# Altium schematic sheet BQ78350.SchDoc
size A3
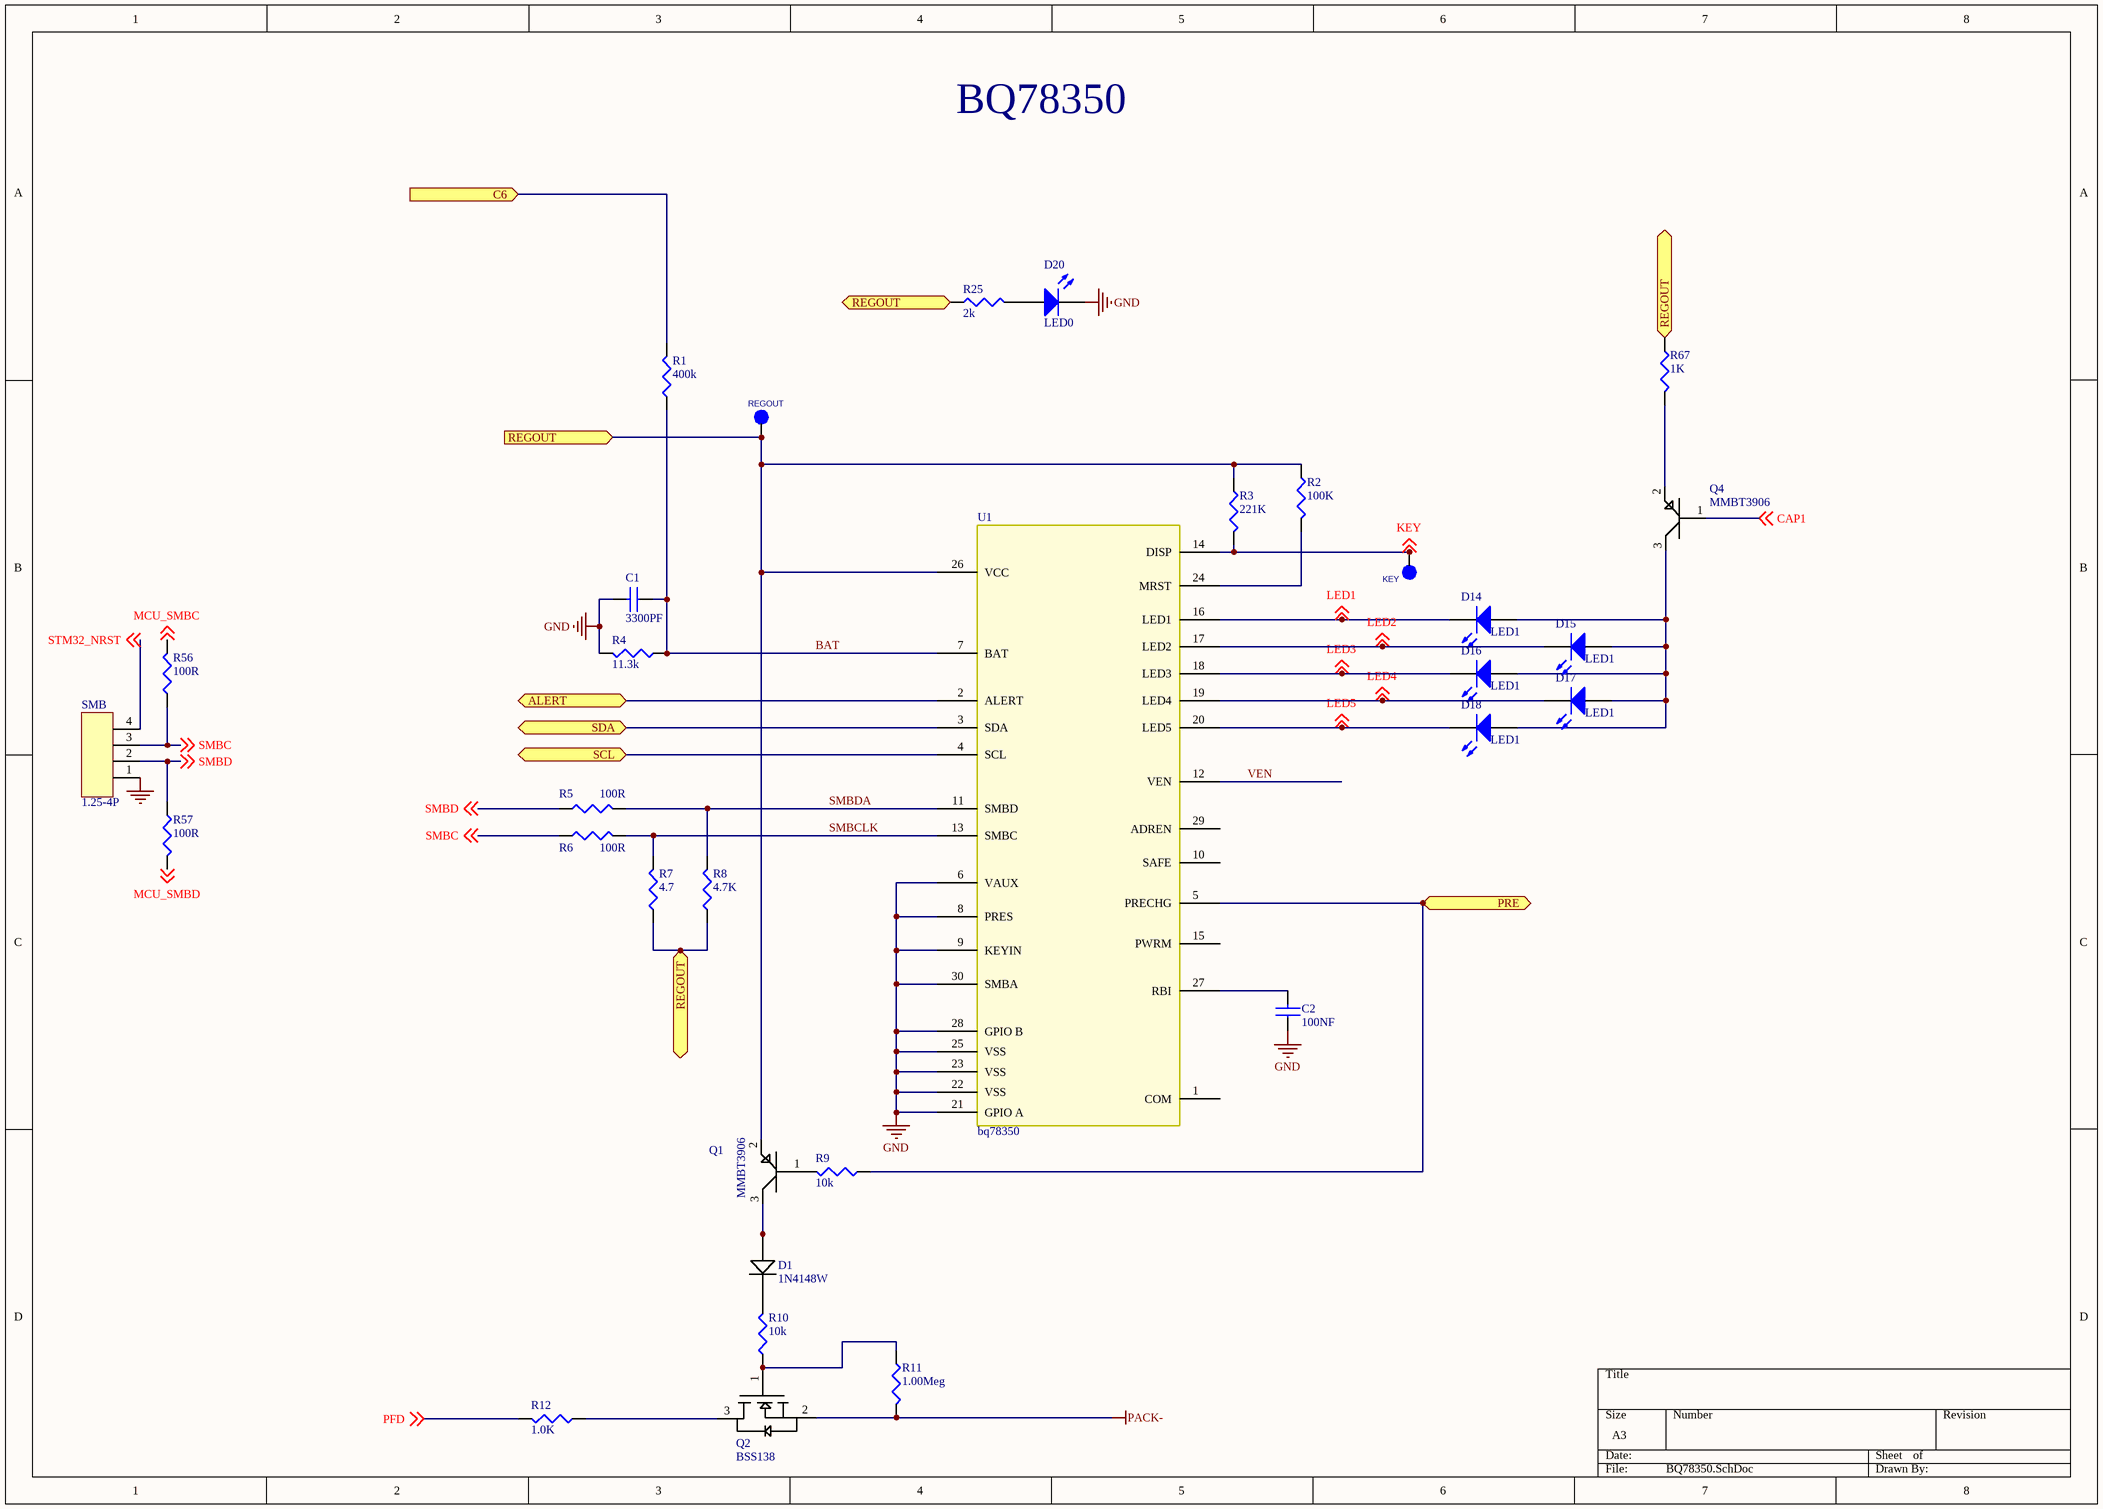
[diagram p0: BQ78350.SchDoc]

## Parts
C1  3300PF  [0402cap]
C2  100NF  [0402cap]
D1  1N4148W  [SOD-123]
D14  LED1  [0603-LED-YE]
D15  LED1  [0603-LED-YE]
D16  LED1  [0603-LED-YE]
D17  LED1  [0603-LED-YE]
D18  LED1  [0603-LED-YE]
D20  LED0  [0603-led-b]
KEY  tpad_020  [tpad_020]  (value not drawn)
Q1  MMBT3906  [SOT-23 - duplicate]
Q2  BSS138  [SOT-23 - duplicate]
Q4  MMBT3906  [SOT-23 - duplicate]
R1  400k  [0603R]
R2  100K  [0603R]
R3  221K  [0603R]
R4  11.3k  [0603R]
R5  100R  [0603R]
R6  100R  [0603R]
R7  4.7  [0603R]
R8  4.7K  [0603R]
R9  10k  [0603R]
R10  10k  [0603R]
R11  1.00Meg  [0603R]
R12  1.0K  [R0805]
R25  2k  [0603R]
R56  100R  [0402r]
R57  100R  [0402r]
R67  1K  [0603R]
REGOUT  tpad_020  [tpad_020]  (value not drawn)
SMB  1.25-4P  [GH1.25-4P]
U1  bq78350  [TSSOP30]

## Ports
ALERT, C6 (in), PRE, REGOUT (in), SCL, SDA

## Nets
GND: C1.2 C2.1 D20.C R4.2 SMB.1 U1.6(VAUX) U1.8(PRES) U1.9(KEYIN) U1.21(GPIO_A) U1.22(VSS) U1.23(VSS) U1.25(VSS) U1.28(GPIO_B) U1.30(SMBA)
PACK-: Q2.2(S) R11.2
ALERT: U1.2(ALERT) ; port ALERT
BAT: C1.1 R1.1 R4.1 U1.7(BAT)
C6: R1.2 ; port C6
CAP1: Q4.1(base) ; off-sheet CAP1
KEY: KEY.1(Pin1) R3.2 U1.14(DISP) ; off-sheet KEY
LED1: D14.C U1.16(LED1) ; off-sheet LED1
LED2: D15.C U1.17(LED2) ; off-sheet LED2
LED3: D16.C U1.18(LED3) ; off-sheet LED3
LED4: D17.C U1.19(LED4) ; off-sheet LED4
LED5: D18.C U1.20(LED5) ; off-sheet LED5
MCU_SMBC: R56.2 ; off-sheet MCU_SMBC
MCU_SMBD: R57.2 ; off-sheet MCU_SMBD
PFD: R12.2 ; off-sheet PFD
PRE: R9.1 U1.5(PRECHG) ; port PRE
REGOUT: Q1.2(emitter) R2.1 R3.1 R7.1 R8.1 R25.1 R67.1 REGOUT.1(Pin1) U1.26(VCC) ; port REGOUT
SCL: U1.4(SCL) ; port SCL
SDA: U1.3(SDA) ; port SDA
SMBC: R6.1 R56.1 SMB.3 ; off-sheet SMBC
SMBCLK: R6.2 R7.2 U1.13(SMBC)
SMBD: R5.1 R57.1 SMB.2 ; off-sheet SMBD
SMBDA: R5.2 R8.2 U1.11(SMBD)
STM32_NRST: SMB.4 ; off-sheet STM32_NRST
VEN: U1.12(VEN)
NetC2_2: C2.2 U1.27(RBI)
NetD1_A: D1.A Q1.3(collector)
NetD1_K: D1.K R10.2
NetD14_A: D14.A D15.A D16.A D17.A D18.A Q4.3(collector)
NetD20_A: D20.A R25.2
NetQ1_1: Q1.1(base) R9.2
NetQ2_1: Q2.1(G) R10.1 R11.1
NetQ2_3: Q2.3(D) R12.1
NetQ4_2: Q4.2(emitter) R67.2
NetR2_2: R2.2 U1.24(MRST)

Not connected (* = marked no-connect by the designer): U1 1(COM) 10(SAFE) 15(PWRM) 29(ADREN)

## Notes on the sheet
- BQ78350

## Library data of the parts
C1 = C1005X5R1H104K: CAP CER .10UF 50V X5R 10% 0402; Manufacturer: TDK Corporation; Capacitance: 0.1礔; Value: 100nF; .Checked PCB: used; Tolerance: ?0%; Category: Capacitors; Manufacturer Part Number: C1005X5R1H104K; Operating Temperature: -55癈 ~ 85癈; Package / Case: 0402 (1005 Metric); Price 1k [$]: 0.02340; .Checked SCH: used; Voltage - Rated: 50V; Supplier Part Number: 445-5942-1-ND; Supplier: Digikey; Supplier 1: Digi-Key; Supplier Part Number 1: 445-5942-1-ND; RoHS: RoHS Compliant; Stock 1: 106926; Pricing 1: 1=0.27, 10=0.18, 100=0.072, 250=0.05176, 500=0.0369, 1000=0.027 (USD); Temperature Coefficient: X5R; Mounting Type: Surface Mount, MLCC; Applications: General Purpose; Ratings: -; Size / Dimension: 0.039" L x 0.020" W (1.00mm x 0.50mm); Height - Seated (Max): -; Thickness (Max): 0.022" (0.55mm); Lead Spacing: -; Features: -; Packaging: Cut Tape (CT); Lead Style: -; ComponentLink1URL: http://www.tdk.co.jp/tefe02/e412_c.pdf; ComponentLink1Description: http://www.tdk.co.jp/tefe02/e412_c.pdf
C2 = C1005X5R1H104K: CAP CER .10UF 50V X5R 10% 0402; Manufacturer: TDK Corporation; Capacitance: 0.1礔; .Checked PCB: used; Tolerance: ?0%; Category: Capacitors; Manufacturer Part Number: C1005X5R1H104K; Operating Temperature: -55癈 ~ 85癈; Package / Case: 0402 (1005 Metric); Price 1k [$]: 0.02340; Value: 100nF; .Checked SCH: used; Voltage - Rated: 50V; Supplier Part Number: 445-5942-1-ND; Supplier: Digikey; Supplier 1: Digi-Key; Supplier Part Number 1: 445-5942-1-ND; RoHS: RoHS Compliant; Stock 1: 106926; Pricing 1: 1=0.27, 10=0.18, 100=0.072, 250=0.05176, 500=0.0369, 1000=0.027 (USD); Temperature Coefficient: X5R; Mounting Type: Surface Mount, MLCC; Applications: General Purpose; Ratings: -; Size / Dimension: 0.039" L x 0.020" W (1.00mm x 0.50mm); Height - Seated (Max): -; Thickness (Max): 0.022" (0.55mm); Lead Spacing: -; Features: -; Packaging: Cut Tape (CT); Lead Style: -; ComponentLink1URL: http://www.tdk.co.jp/tefe02/e412_c.pdf; ComponentLink1Description: http://www.tdk.co.jp/tefe02/e412_c.pdf
D14-D18 = LED1: Typical RED GaAs LED; Published: 8-Jun-2000; LatestRevisionDate: 08-Jul-2005; LatestRevisionNote: Mech Layer 1 removed.; PackageReference: LED-1; Publisher: Altium Limited; PackageDescription: LED; 2 Leads
D20 = LED0: Typical INFRARED GaAs LED; Published: 8-Jun-2000; LatestRevisionDate: 08-Jul-2005; LatestRevisionNote: Mech Layer 1 removed.; PackageReference: LED-0; Publisher: Altium Limited; PackageDescription: LED; 2 Leads
KEY REGOUT = TESTLOOP: TEST POINT PAD 0.5MM DIA SMT, NO PART TO ORDER; CLASS: IO; AGILE_PN: 211-77484; ASSY_OPT: DNP; CAD_APPROVED: Yes; ROHS: Yes; HEIGHT: 0.1MM
R1-R12 R25 R56 R57 R67 = RMCF0402FT4K99: RES TF 4.99K OHM 1% 1/16W 0402; Manufacturer: Stackpole Electronics Inc; Power (Watts): 0.063W, 1/16W; Tolerance: ?%; Value: 4k99; .Checked PCB: used; Temperature Coefficient: ?00ppm/癈; Category: Resistors; Supplier Part Number: RMCF0402FT4K99CT-ND; Manufacturer Part Number: RMCF0402FT4K99; Package / Case: 0402 (1005 Metric); Price 1k [$]: 0.00384; Resistance (Ohms): 4.99K; .Checked SCH: used; Supplier: Digikey; Supplier 1: Digi-Key; Supplier Part Number 1: RMCF0402FT4K99CT-ND; RoHS: RoHS Compliant; Stock 1: 48509; Pricing 1: 1=0.04, 10=0.025, 50=0.0138, 100=0.0105, 250=0.0078, 500=0.00576, 1000=0.00384 (USD); Composition: Thick Film; Features: -; Size / Dimension: 0.039" L x 0.020" W (1.00mm x 0.50mm); Height: 0.016" (0.40mm); Number of Terminations: 2; Packaging: Cut Tape (CT); ComponentLink1URL: http://www.seielect.com/Catalog/SEI-RMCF.pdf; ComponentLink1Description: http://www.seielect.com/Catalog/SEI-RMCF.pdf